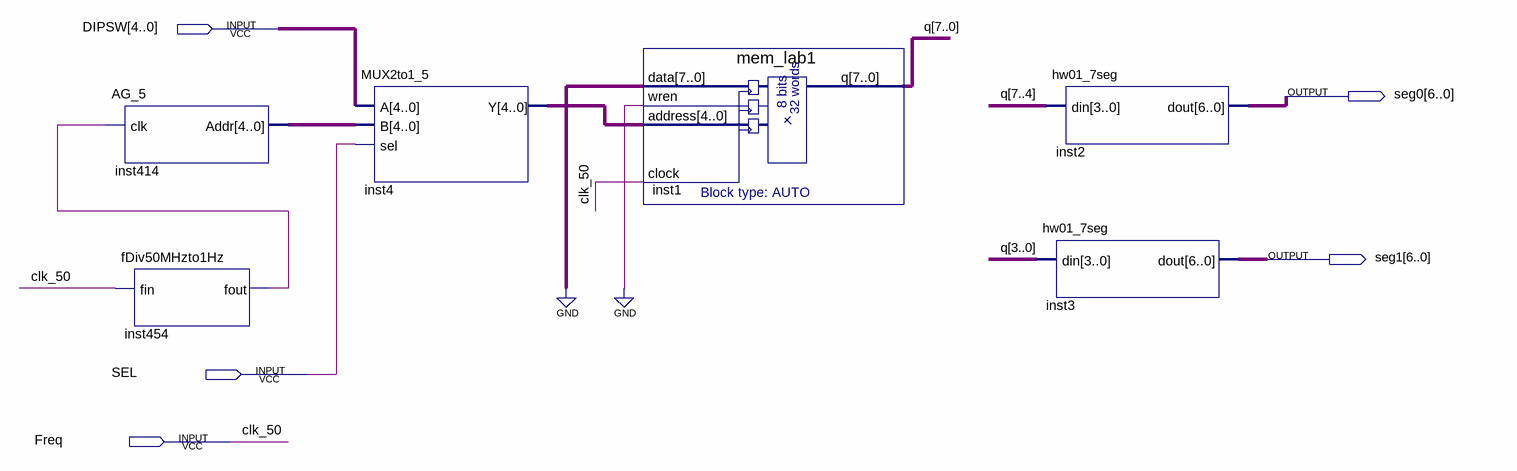
[diagram p0: schematic sheet]
// Quartus schematic lab1.bdf as structural Verilog: 6 symbols, 5 pins
module lab1 (
  input  [4:0] DIPSW,
  input  SEL,
  input  Freq,
  output [6:0] seg0,
  output [6:0] seg1
);

  wire inst454_fout;
  wire [4:0] inst4_y, inst414_addr;
  wire [7:0] q;

  AG_5 inst414 (.clk(inst454_fout), .Addr(inst414_addr));
  fDiv50MHzto1Hz inst454 (.fin(Freq), .fout(inst454_fout));
  MUX2to1_5 inst4 (.A(DIPSW), .B(inst414_addr), .sel(SEL), .Y(inst4_y));
  mem_lab1 inst1 (.data({8{1'b0}}), .wren(1'b0), .address(inst4_y), .clock(Freq), .q(q));
  hw01_7seg inst2 (.din(q[7:4]), .dout(seg0));
  hw01_7seg inst3 (.din(q[3:0]), .dout(seg1));

  // Other names for the same wires on the sheet: clk_50 = Freq
endmodule
